# EAGLE design module_Rx_mux (EAGLE 6.5.0)

## Sheet 1 of 4
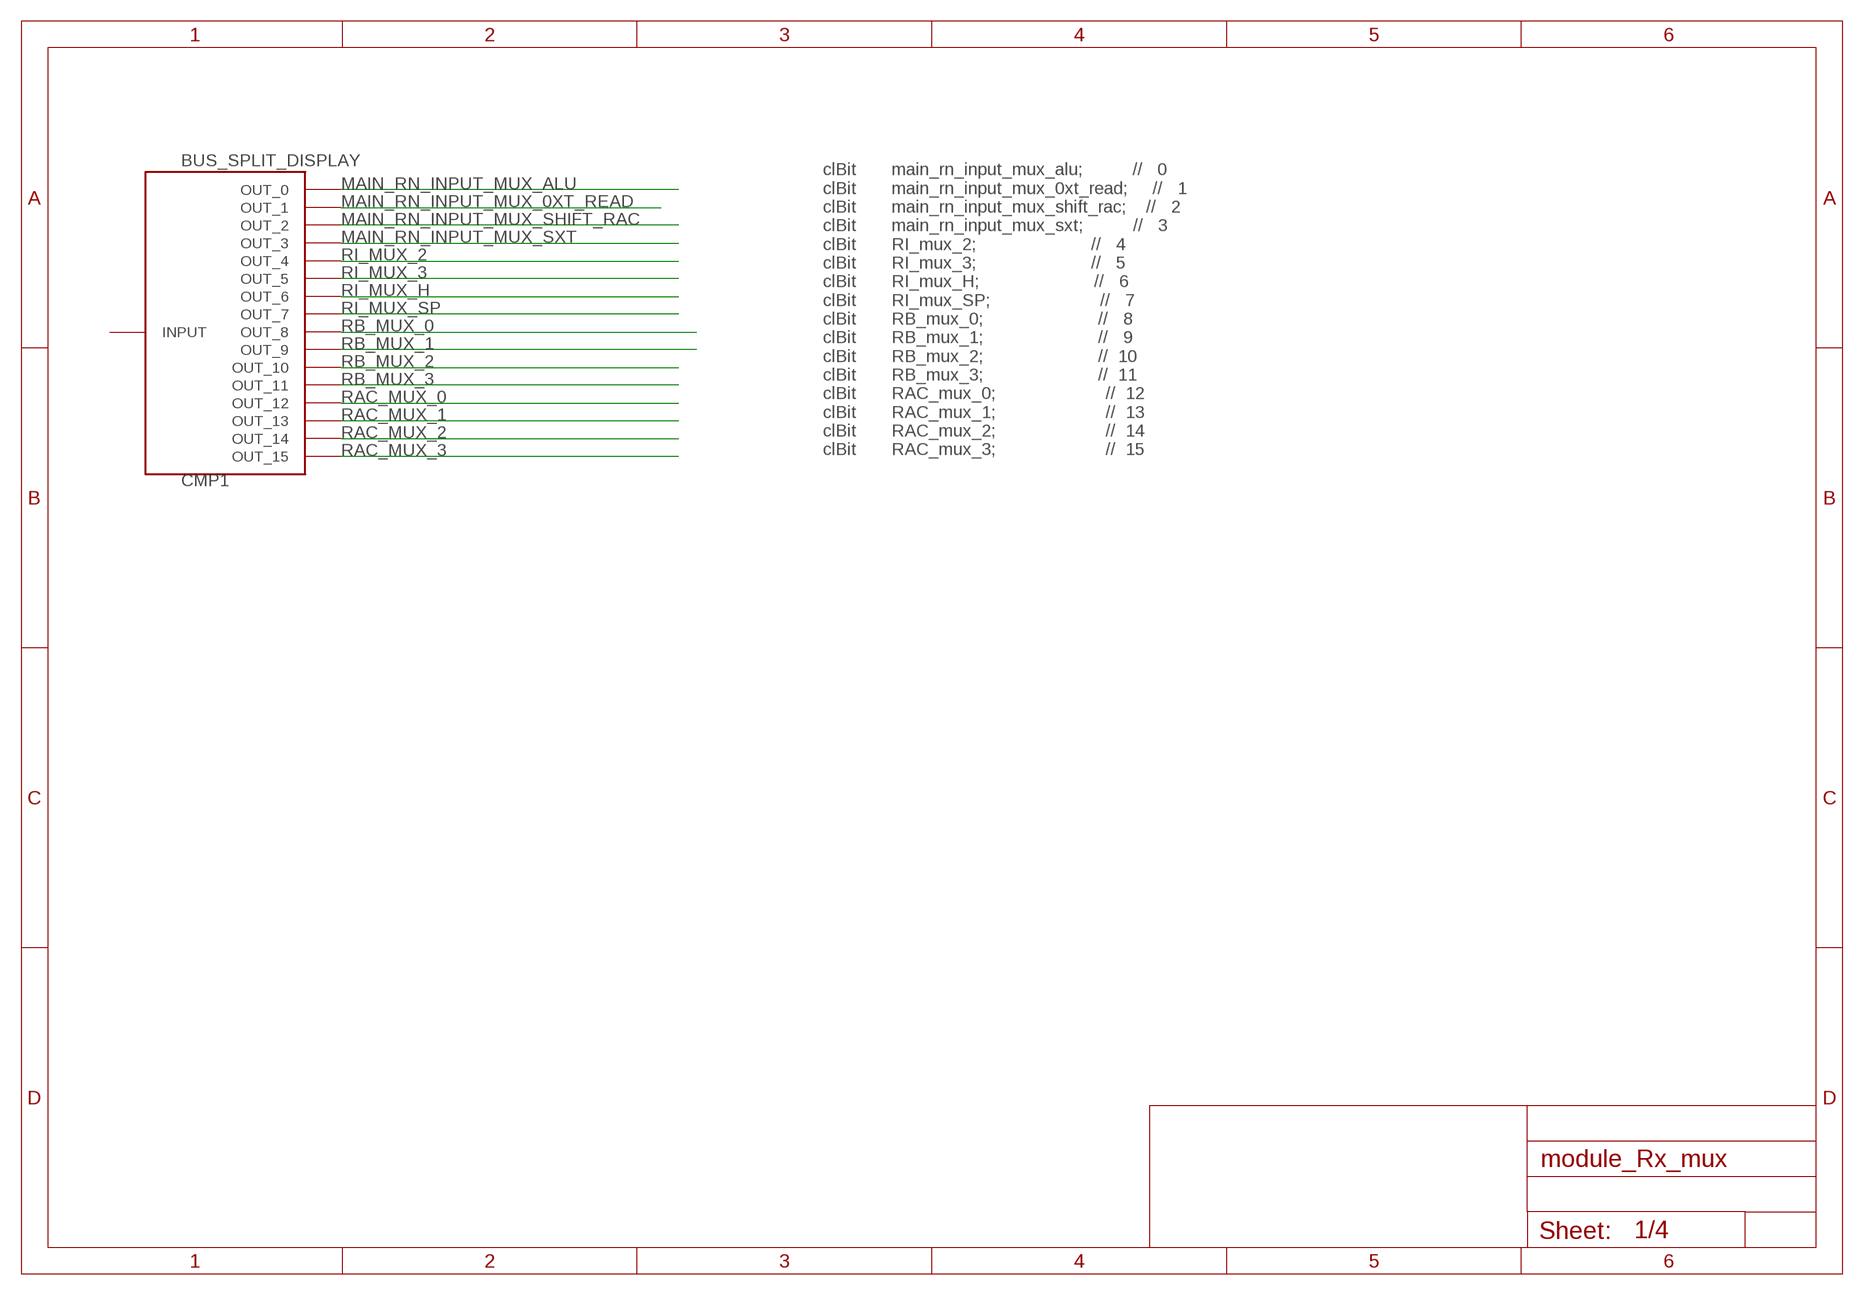
[diagram p0: schematic, sheet 1]

### Parts
CMP1  BUS_SPLIT_DISPLAY  [BUS_SPLIT_DISPLAY]

### Nets
MAIN_RN_INPUT_MUX_0XT_READ: CMP1.P$2(OUT_1) ; also sheet 4
MAIN_RN_INPUT_MUX_ALU: CMP1.P$1(OUT_0) ; also sheet 4
MAIN_RN_INPUT_MUX_SHIFT_RAC: CMP1.P$3(OUT_2) ; also sheet 4
MAIN_RN_INPUT_MUX_SXT: CMP1.P$4(OUT_3) ; also sheet 4
RAC_MUX_0: CMP1.P$13(OUT_12) ; also sheet 4
RAC_MUX_1: CMP1.P$14(OUT_13) ; also sheet 4
RAC_MUX_2: CMP1.P$15(OUT_14) ; also sheet 4
RAC_MUX_3: CMP1.P$16(OUT_15) ; also sheet 4
RB_MUX_0: CMP1.P$9(OUT_8) ; also sheet 4
RB_MUX_1: CMP1.P$10(OUT_9) ; also sheet 4
RB_MUX_2: CMP1.P$11(OUT_10) ; also sheet 4
RB_MUX_3: CMP1.P$12(OUT_11) ; also sheet 4
RI_MUX_2: CMP1.P$5(OUT_4) ; also sheet 4
RI_MUX_3: CMP1.P$6(OUT_5) ; also sheet 4
RI_MUX_H: CMP1.P$7(OUT_6) ; also sheet 4
RI_MUX_SP: CMP1.P$8(OUT_7) ; also sheet 4
Unconnected: CMP1.INPUT

### Notes on the sheet
- clBit       main_rn_input_mux_alu;          //   0
      clBit       main_rn_input_mux_0xt_read;     //   1
      clBit       main_rn_input_mux_shift_rac;    //   2
      clBit       main_rn_input_mux_sxt;          //   3
      clBit       RI_mux_2;                       //   4
      clBit       RI_mux_3;                       //   5
      clBit       RI_mux_H;                       //   6
      clBit       RI_mux_SP;                      //   7
      clBit       RB_mux_0;                       //   8
      clBit       RB_mux_1;                       //   9
      clBit       RB_mux_2;                       //  10
      clBit       RB_mux_3;                       //  11
      clBit       RAC_mux_0;                      //  12
      clBit       RAC_mux_1;                      //  13
      clBit       RAC_mux_2;                      //  14
      clBit       RAC_mux_3;                      //  15

## Sheet 2 of 4
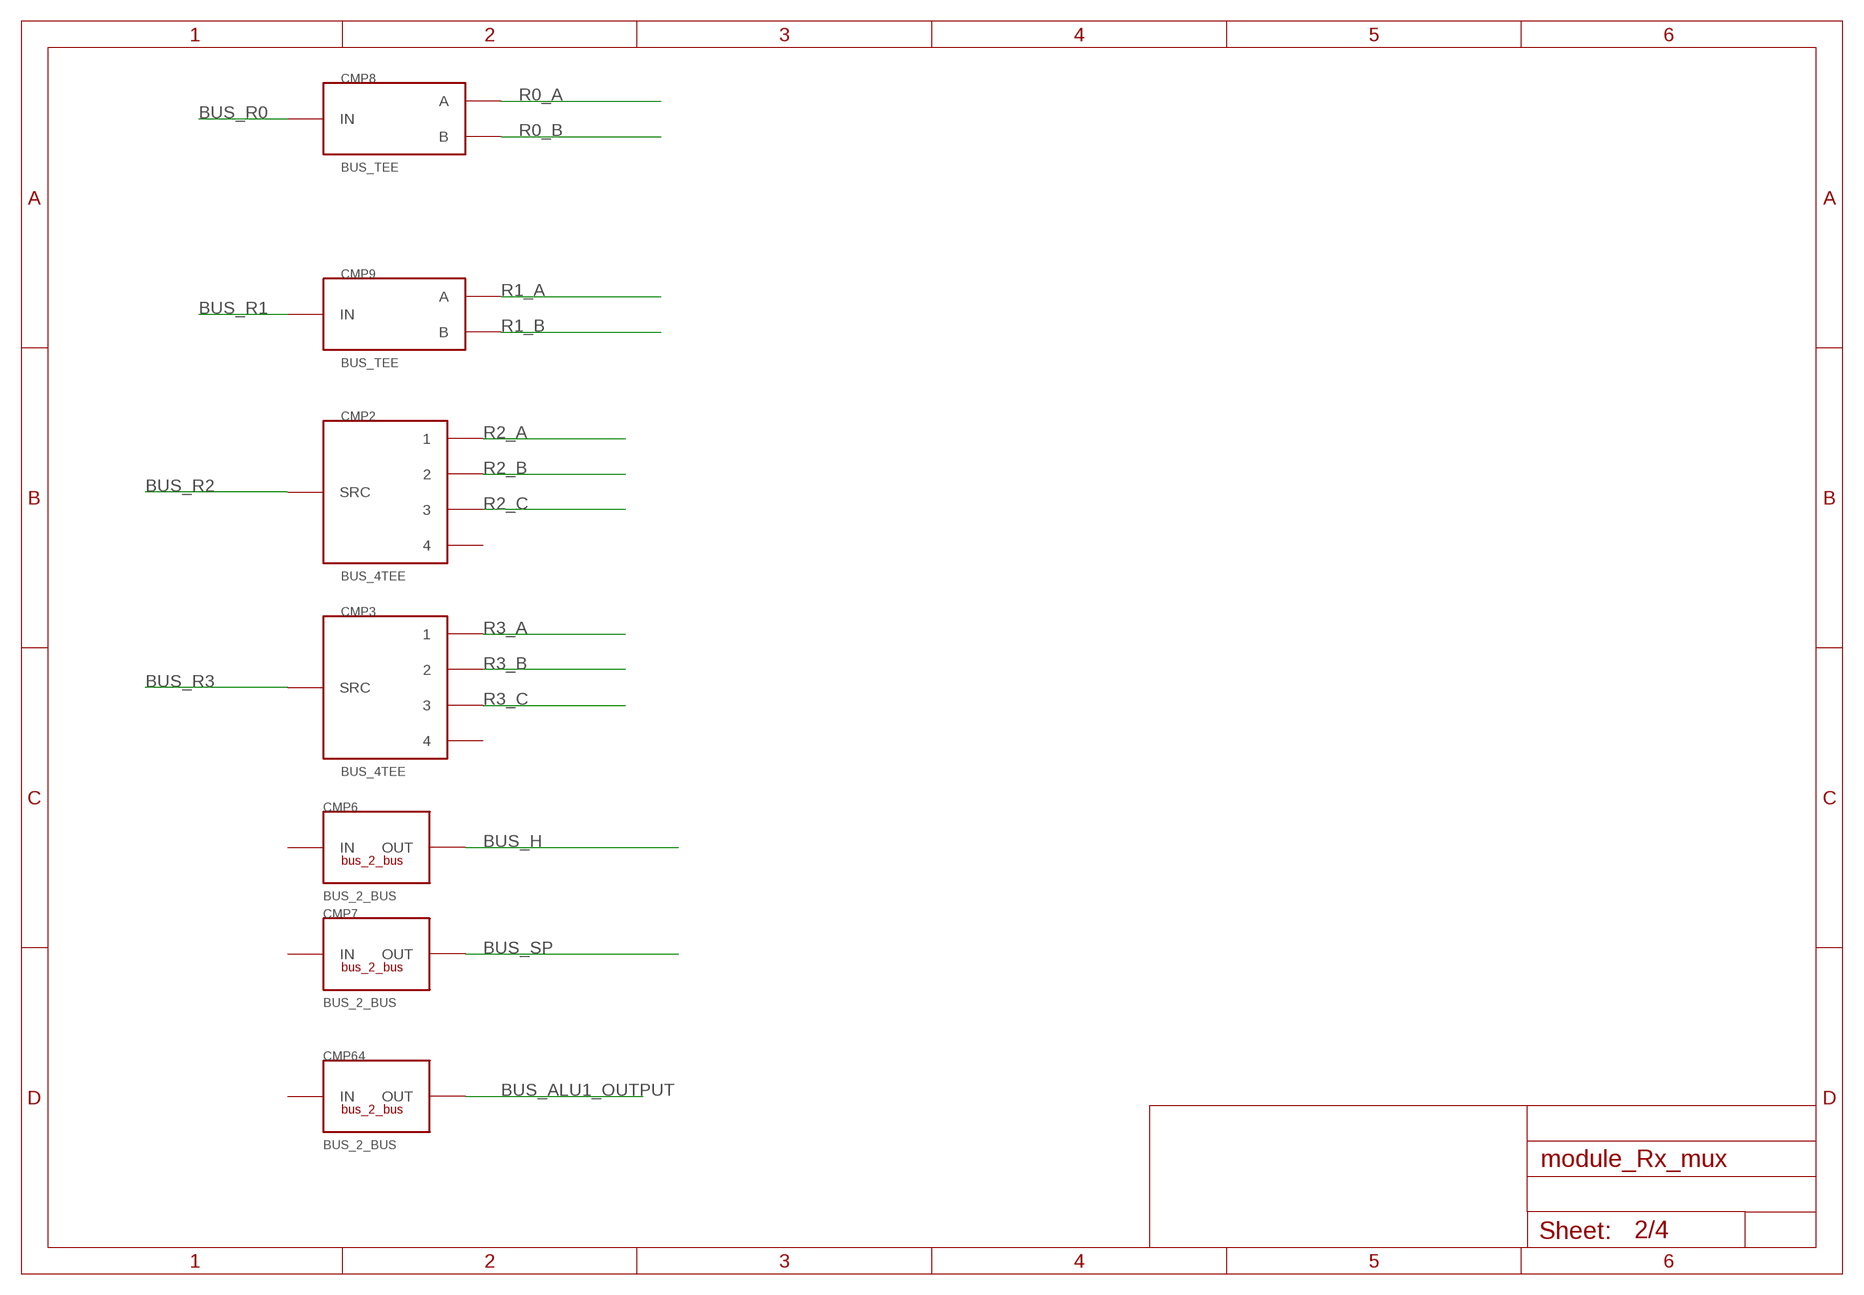
[diagram p1: schematic, sheet 2]

### Parts
CMP2  BUS_4TEE  [BUS_4TEE]
CMP3  BUS_4TEE  [BUS_4TEE]
CMP6  BUS_2_BUS  [BUS2BUS]
CMP7  BUS_2_BUS  [BUS2BUS]
CMP8  BUS_TEE  [BUS_TEE]
CMP9  BUS_TEE  [BUS_TEE]
CMP64  BUS_2_BUS  [BUS2BUS]

### Nets
BUS_ALU1_OUTPUT: CMP64.P$2(OUT) ; also sheet 4
BUS_H: CMP6.P$2(OUT) ; also sheet 4
BUS_R0: CMP8.INPUT(IN)
BUS_R1: CMP9.INPUT(IN)
BUS_R2: CMP2.SRC
BUS_R3: CMP3.SRC
BUS_SP: CMP7.P$2(OUT) ; also sheet 4
R0_A: CMP8.OUT_A(A) ; also sheet 4
R0_B: CMP8.OUTB(B) ; also sheet 4
R1_A: CMP9.OUT_A(A) ; also sheet 4
R1_B: CMP9.OUTB(B) ; also sheet 4
R2_A: CMP2.1 ; also sheet 4
R2_B: CMP2.2 ; also sheet 4
R2_C: CMP2.3 ; also sheet 4
R3_A: CMP3.1 ; also sheet 4
R3_B: CMP3.2 ; also sheet 4
R3_C: CMP3.3 ; also sheet 4
Unconnected: CMP2.4 CMP3.4 CMP6.P$1(IN) CMP7.P$1(IN) CMP64.P$1(IN)

## Sheet 3 of 4
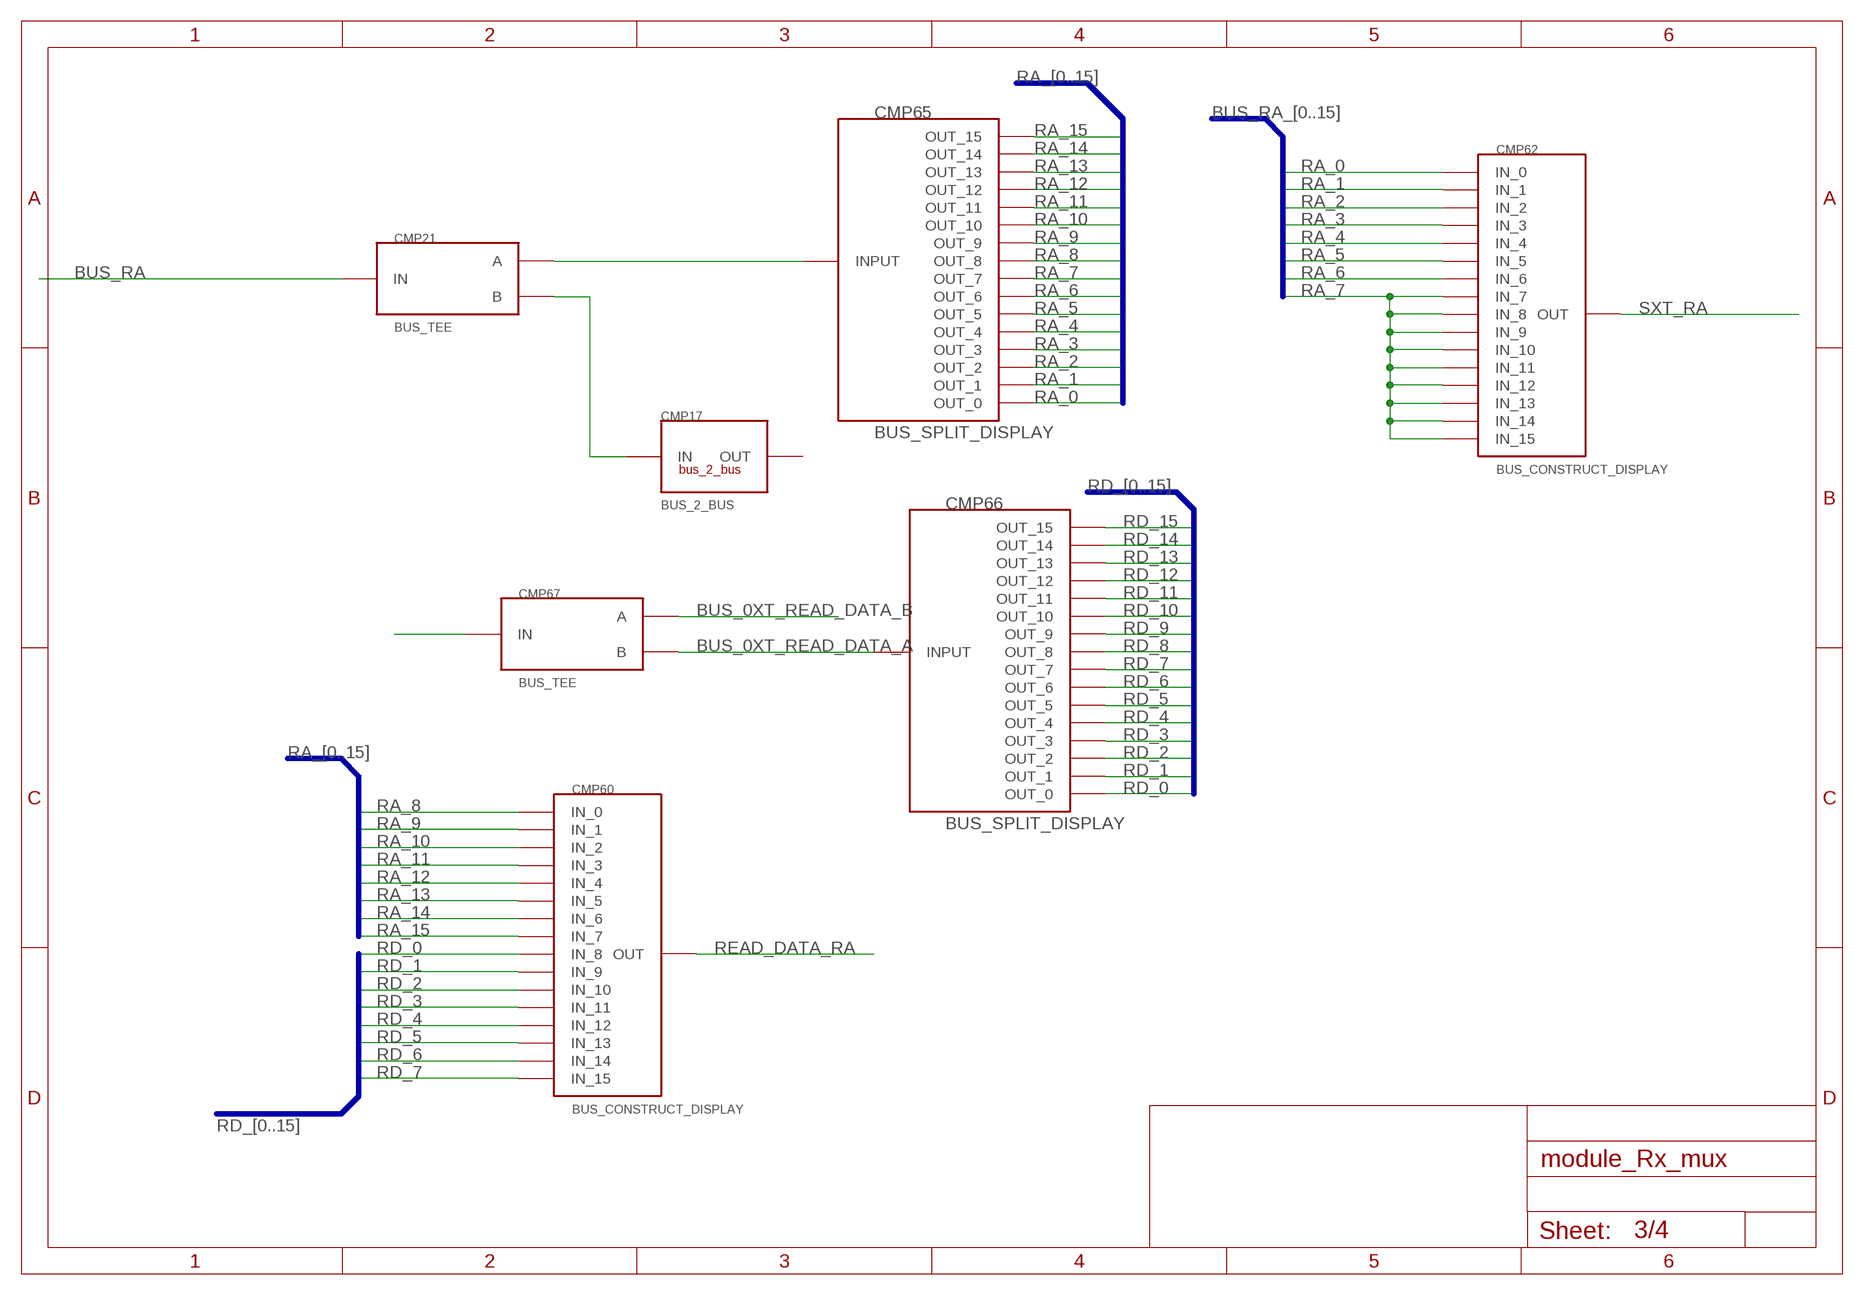
[diagram p2: schematic, sheet 3]

### Parts
CMP17  BUS_2_BUS  [BUS2BUS]
CMP21  BUS_TEE  [BUS_TEE]
CMP60  BUS_CONSTRUCT_DISPLAY  [BUS_SPLIT_DISPLAY]
CMP62  BUS_CONSTRUCT_DISPLAY  [BUS_SPLIT_DISPLAY]
CMP65  BUS_SPLIT_DISPLAY  [BUS_SPLIT_DISPLAY]
CMP66  BUS_SPLIT_DISPLAY  [BUS_SPLIT_DISPLAY]
CMP67  BUS_TEE  [BUS_TEE]

### Nets
BUS_0XT_READ_DATA_A: CMP66.INPUT CMP67.OUTB(B)
BUS_0XT_READ_DATA_B: CMP67.OUT_A(A) ; also sheet 4
BUS_RA: CMP21.INPUT(IN) ; also sheet 4
N$2: CMP21.OUT_A(A) CMP65.INPUT
N$3: CMP17.P$1(IN) CMP21.OUTB(B)
N$31: CMP67.INPUT(IN)
RA_0: CMP62.P$1(IN_0) CMP65.P$1(OUT_0)
RA_1: CMP62.P$2(IN_1) CMP65.P$2(OUT_1)
RA_2: CMP62.P$3(IN_2) CMP65.P$3(OUT_2)
RA_3: CMP62.P$4(IN_3) CMP65.P$4(OUT_3)
RA_4: CMP62.P$5(IN_4) CMP65.P$5(OUT_4)
RA_5: CMP62.P$6(IN_5) CMP65.P$6(OUT_5)
RA_6: CMP62.P$7(IN_6) CMP65.P$7(OUT_6)
RA_7: CMP62.P$8(IN_7) CMP62.P$9(IN_8) CMP62.P$10(IN_9) CMP62.P$11(IN_10) CMP62.P$12(IN_11) CMP62.P$13(IN_12) CMP62.P$14(IN_13) CMP62.P$15(IN_14) CMP62.P$16(IN_15) CMP65.P$8(OUT_7)
RA_8: CMP60.P$1(IN_0) CMP65.P$9(OUT_8)
RA_9: CMP60.P$2(IN_1) CMP65.P$10(OUT_9)
RA_10: CMP60.P$3(IN_2) CMP65.P$11(OUT_10)
RA_11: CMP60.P$4(IN_3) CMP65.P$12(OUT_11)
RA_12: CMP60.P$5(IN_4) CMP65.P$13(OUT_12)
RA_13: CMP60.P$6(IN_5) CMP65.P$14(OUT_13)
RA_14: CMP60.P$7(IN_6) CMP65.P$15(OUT_14)
RA_15: CMP60.P$8(IN_7) CMP65.P$16(OUT_15)
RD_0: CMP60.P$9(IN_8) CMP66.P$1(OUT_0)
RD_1: CMP60.P$10(IN_9) CMP66.P$2(OUT_1)
RD_2: CMP60.P$11(IN_10) CMP66.P$3(OUT_2)
RD_3: CMP60.P$12(IN_11) CMP66.P$4(OUT_3)
RD_4: CMP60.P$13(IN_12) CMP66.P$5(OUT_4)
RD_5: CMP60.P$14(IN_13) CMP66.P$6(OUT_5)
RD_6: CMP60.P$15(IN_14) CMP66.P$7(OUT_6)
RD_7: CMP60.P$16(IN_15) CMP66.P$8(OUT_7)
RD_8: CMP66.P$9(OUT_8)
RD_9: CMP66.P$10(OUT_9)
RD_10: CMP66.P$11(OUT_10)
RD_11: CMP66.P$12(OUT_11)
RD_12: CMP66.P$13(OUT_12)
RD_13: CMP66.P$14(OUT_13)
RD_14: CMP66.P$15(OUT_14)
RD_15: CMP66.P$16(OUT_15)
READ_DATA_RA: CMP60.INPUT(OUT) ; also sheet 4
SXT_RA: CMP62.INPUT(OUT) ; also sheet 4
Unconnected: CMP17.P$2(OUT)

### Buses
BUS_RA_[0..15]
RD_[0..15]
RA_[0..15]

## Sheet 4 of 4
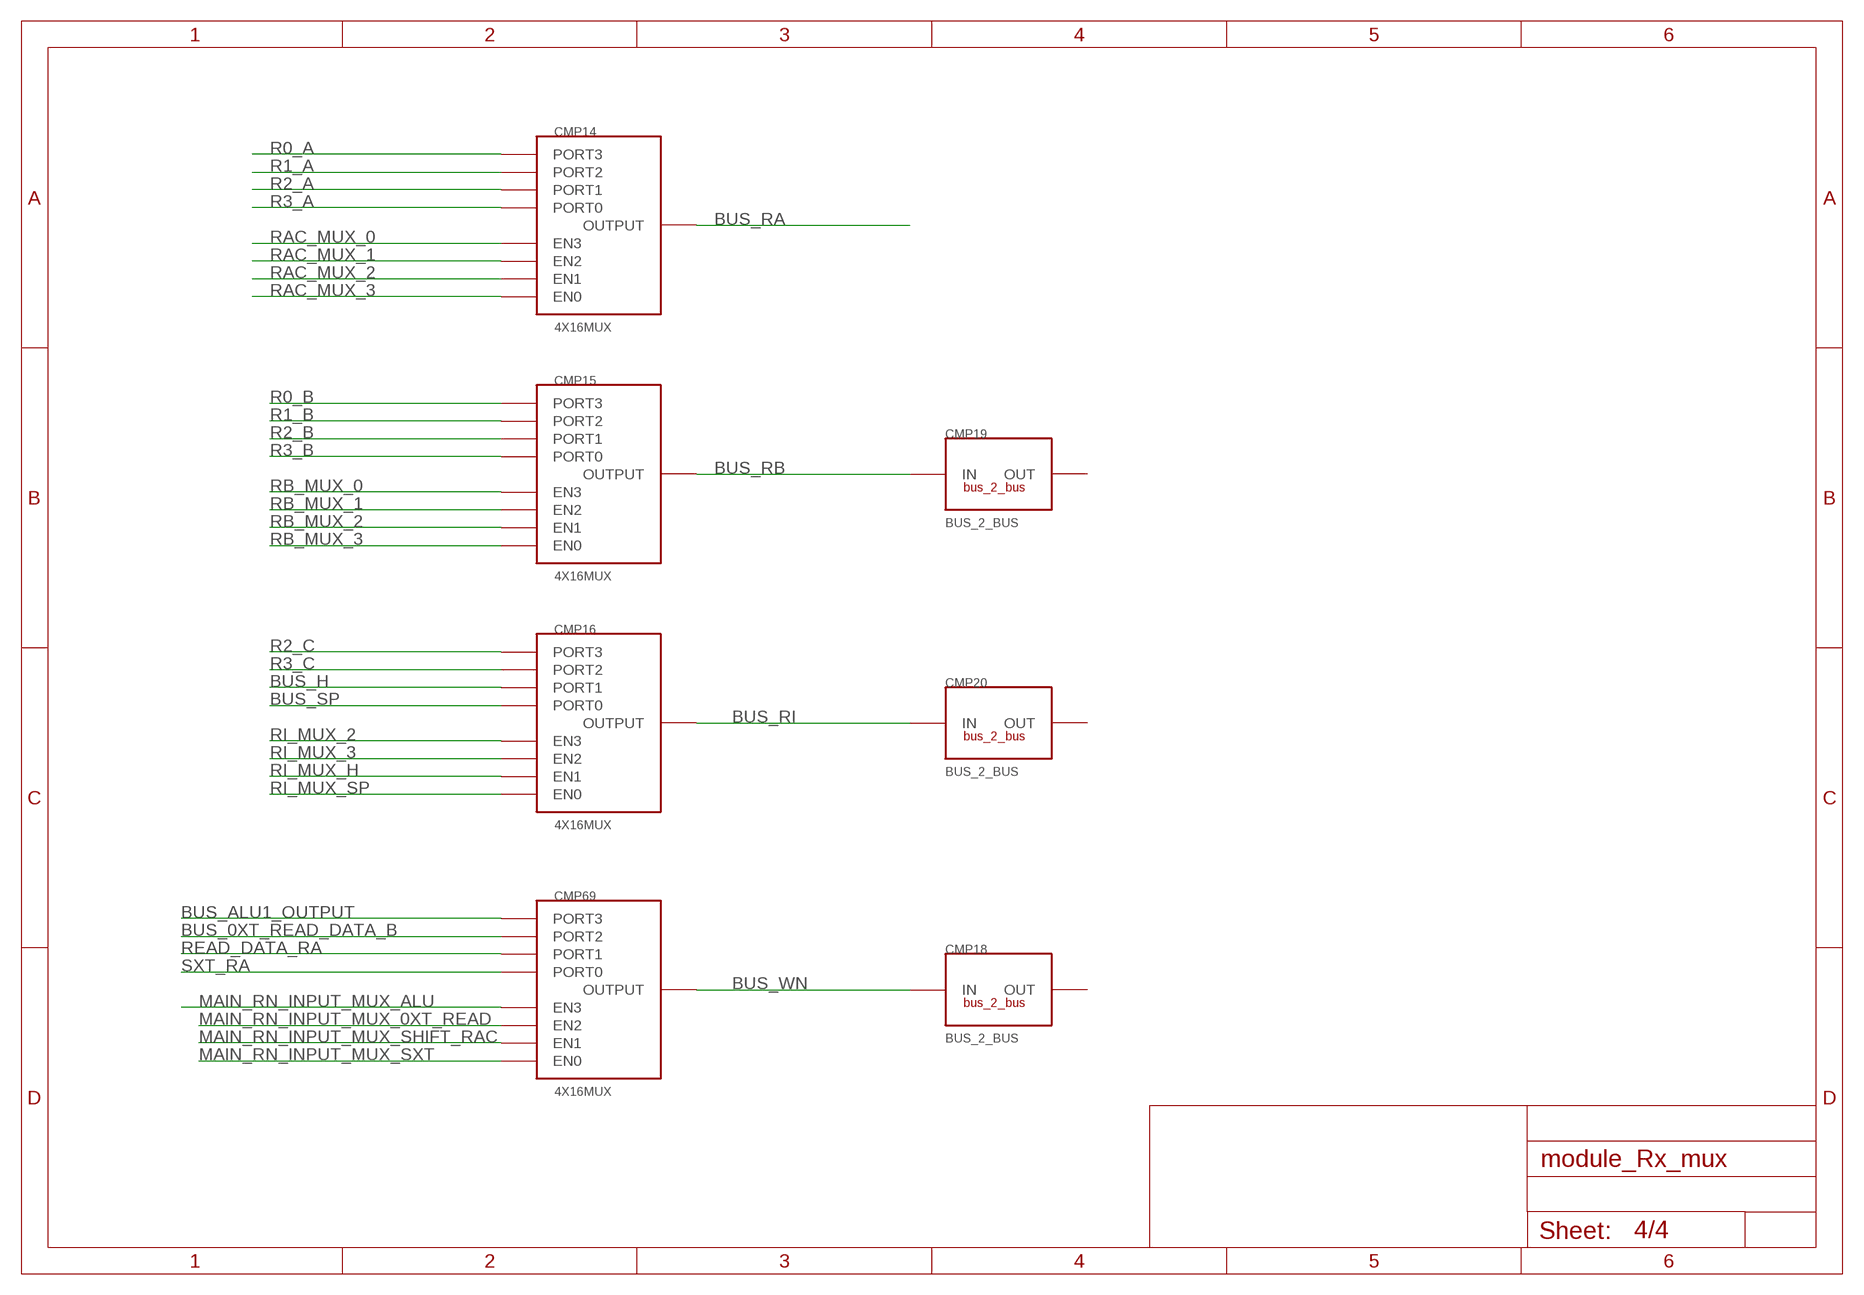
[diagram p3: schematic, sheet 4]

### Parts
CMP14  4X16MUX  [4X16MUX]
CMP15  4X16MUX  [4X16MUX]
CMP16  4X16MUX  [4X16MUX]
CMP18  BUS_2_BUS  [BUS2BUS]
CMP19  BUS_2_BUS  [BUS2BUS]
CMP20  BUS_2_BUS  [BUS2BUS]
CMP69  4X16MUX  [4X16MUX]

### Nets
BUS_0XT_READ_DATA_B: CMP69.PORT2 ; also sheet 3
BUS_ALU1_OUTPUT: CMP69.PORT3 ; also sheet 2
BUS_H: CMP16.PORT1 ; also sheet 2
BUS_RA: CMP14.PORTOUT(OUTPUT) ; also sheet 3
BUS_RB: CMP15.PORTOUT(OUTPUT) CMP19.P$1(IN)
BUS_RI: CMP16.PORTOUT(OUTPUT) CMP20.P$1(IN)
BUS_SP: CMP16.PORT0 ; also sheet 2
BUS_WN: CMP18.P$1(IN) CMP69.PORTOUT(OUTPUT)
MAIN_RN_INPUT_MUX_0XT_READ: CMP69.EN2 ; also sheet 1
MAIN_RN_INPUT_MUX_ALU: CMP69.EN3 ; also sheet 1
MAIN_RN_INPUT_MUX_SHIFT_RAC: CMP69.EN1 ; also sheet 1
MAIN_RN_INPUT_MUX_SXT: CMP69.EN0 ; also sheet 1
R0_A: CMP14.PORT3 ; also sheet 2
R0_B: CMP15.PORT3 ; also sheet 2
R1_A: CMP14.PORT2 ; also sheet 2
R1_B: CMP15.PORT2 ; also sheet 2
R2_A: CMP14.PORT1 ; also sheet 2
R2_B: CMP15.PORT1 ; also sheet 2
R2_C: CMP16.PORT3 ; also sheet 2
R3_A: CMP14.PORT0 ; also sheet 2
R3_B: CMP15.PORT0 ; also sheet 2
R3_C: CMP16.PORT2 ; also sheet 2
RAC_MUX_0: CMP14.EN3 ; also sheet 1
RAC_MUX_1: CMP14.EN2 ; also sheet 1
RAC_MUX_2: CMP14.EN1 ; also sheet 1
RAC_MUX_3: CMP14.EN0 ; also sheet 1
RB_MUX_0: CMP15.EN3 ; also sheet 1
RB_MUX_1: CMP15.EN2 ; also sheet 1
RB_MUX_2: CMP15.EN1 ; also sheet 1
RB_MUX_3: CMP15.EN0 ; also sheet 1
READ_DATA_RA: CMP69.PORT1 ; also sheet 3
RI_MUX_2: CMP16.EN3 ; also sheet 1
RI_MUX_3: CMP16.EN2 ; also sheet 1
RI_MUX_H: CMP16.EN1 ; also sheet 1
RI_MUX_SP: CMP16.EN0 ; also sheet 1
SXT_RA: CMP69.PORT0 ; also sheet 3
Unconnected: CMP18.P$2(OUT) CMP19.P$2(OUT) CMP20.P$2(OUT)

## Library data of the parts
CMP1 CMP65 CMP66 = modules:BUS_SPLIT_DISPLAY
CMP2 CMP3 = modules:BUS_4TEE
CMP6 CMP7 CMP17-CMP20 CMP64 = modules:BUS_2_BUS
CMP8 CMP9 CMP21 CMP67 = modules:BUS_TEE
CMP14-CMP16 CMP69 = modules:4X16MUX
CMP60 CMP62 = modules:BUS_CONSTRUCT_DISPLAY

## Board
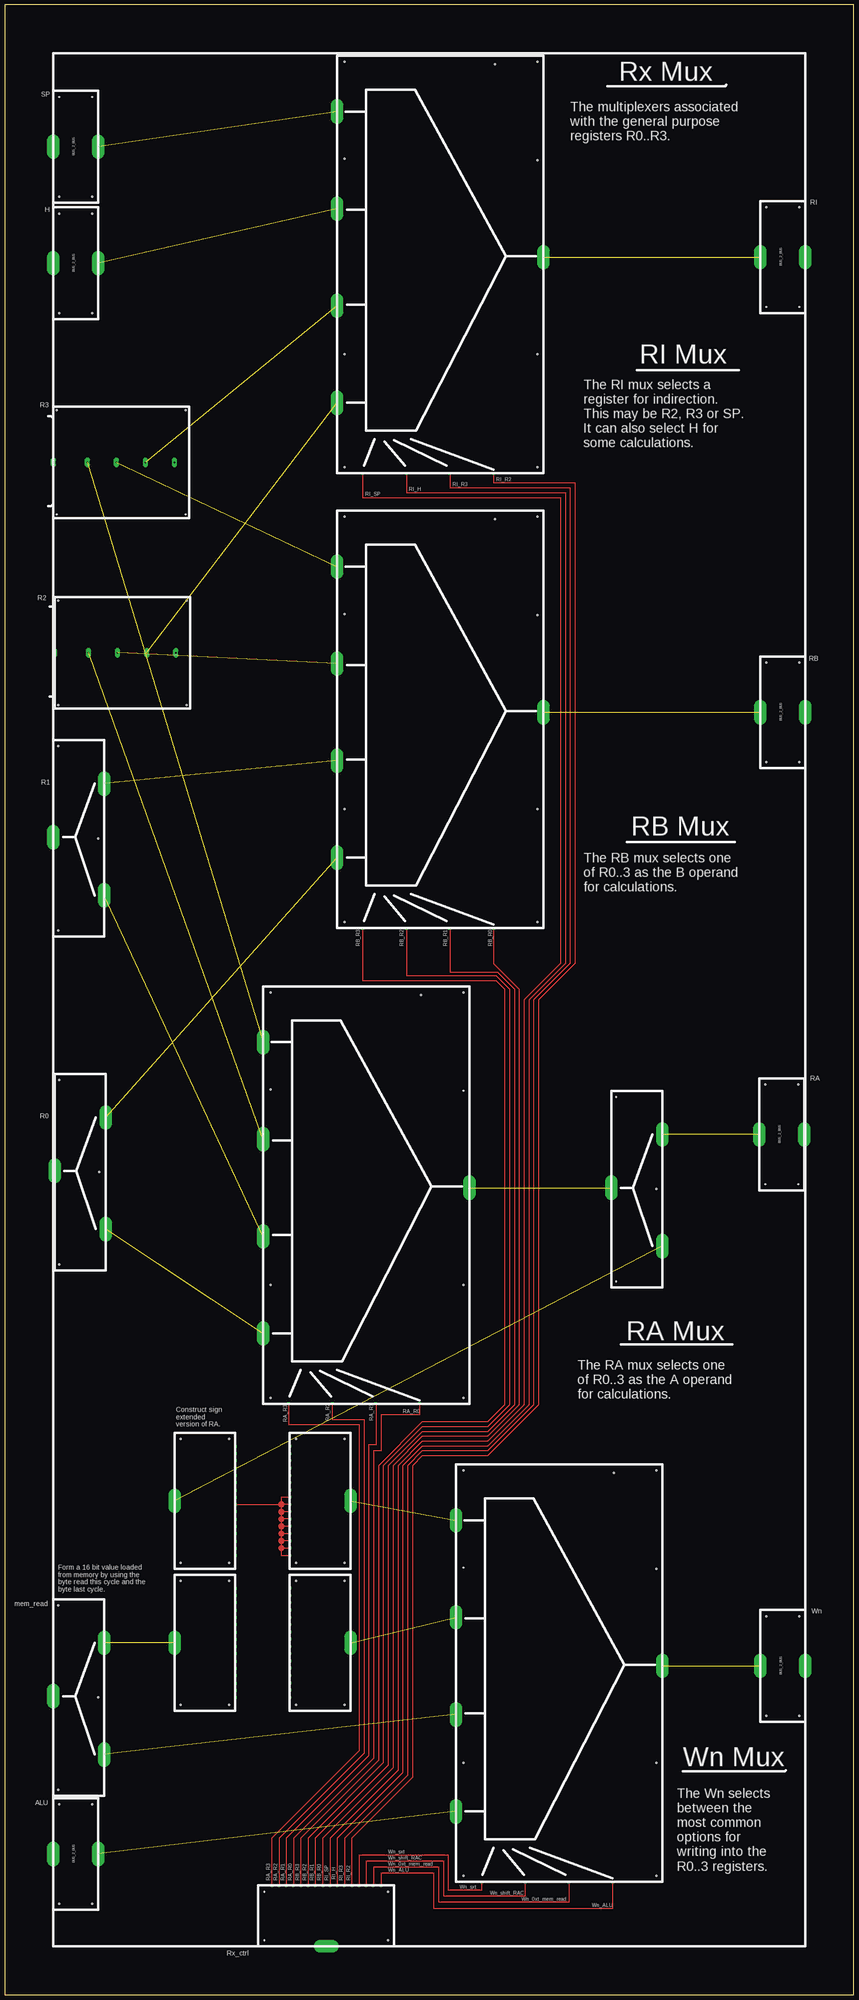
[diagram p4: board, top side]
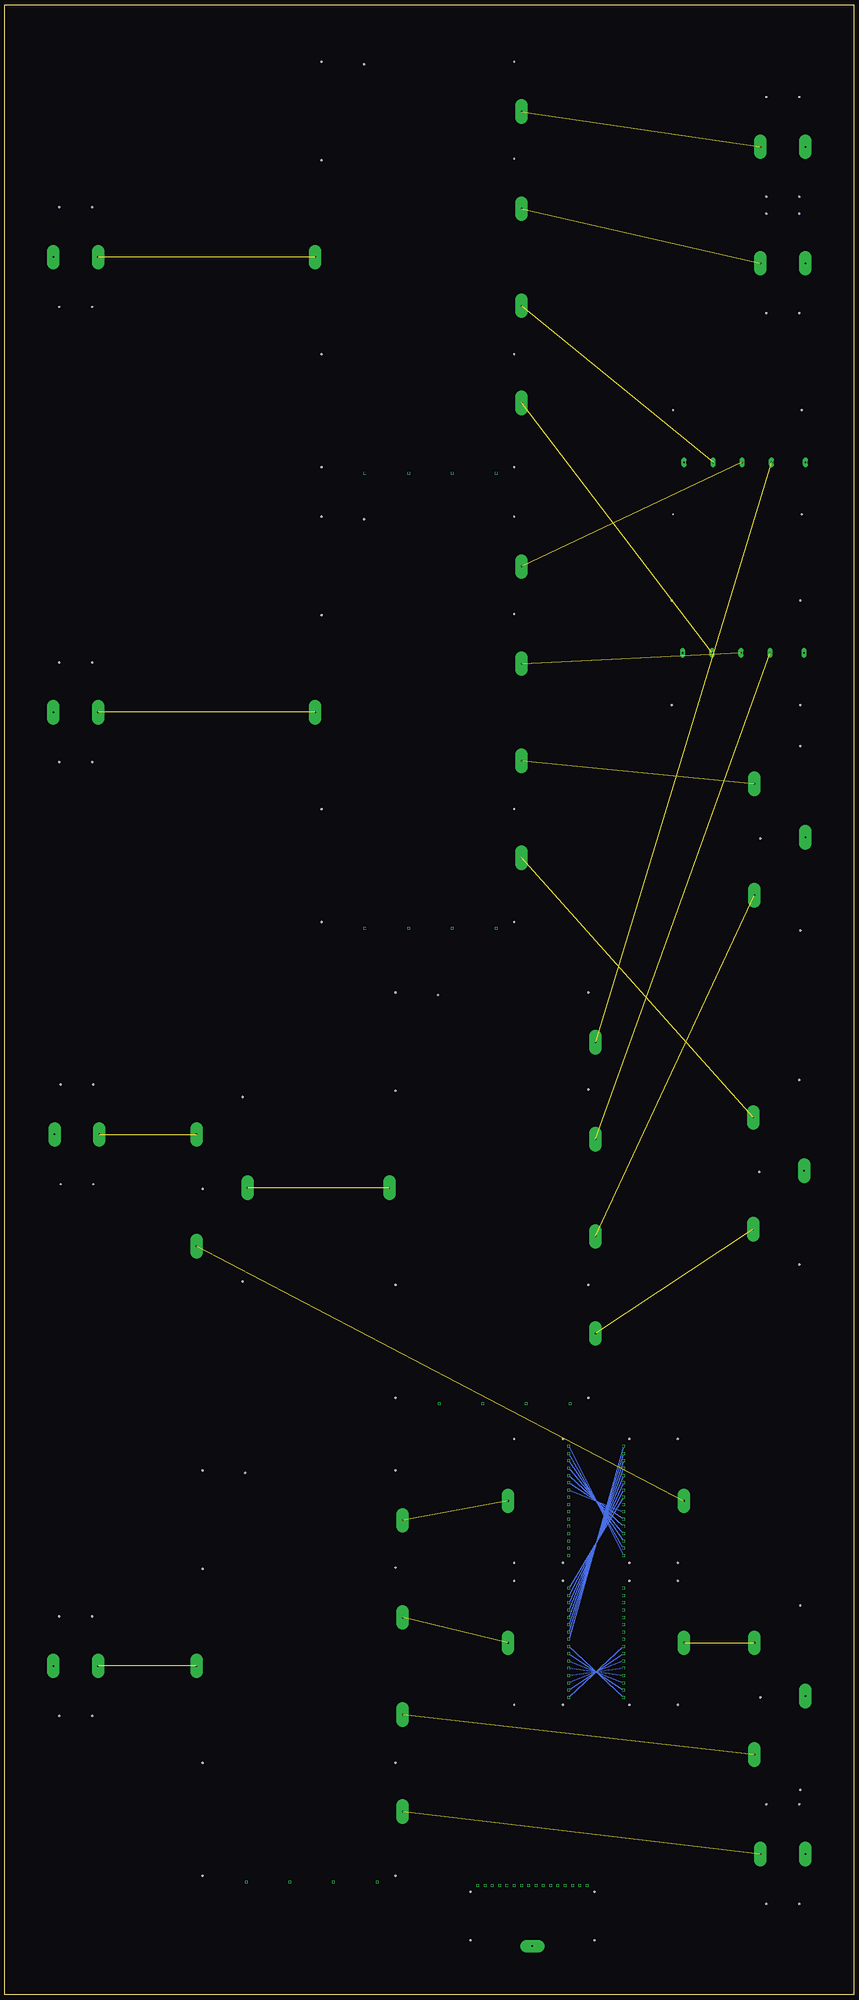
[diagram p5: board, bottom side, seen from below]

Size 444.5 x 1041.4 mm. Coordinates in mm from the lower left corner, seen from the top.
Outline: 444.5,0 444.5,1041.4 0,1041.4 0,0 444.5,0
Copper layers (1*16): Top 0.035mm / dielectric 1.5mm / Bottom 0.035mm
Design rules "default": minimum track width 10mil, minimum drill 24mil, track to track 8mil, track to pad 8mil, pad to pad 8mil, via to via 8mil, smd to smd 8mil, copper to edge 40mil, drill to drill 8mil, minimum pad ring 10mil, minimum via ring 8mil, stop-mask expansion 4mil, vias tented up to drill 0mil, thermal gap 10mil
tKeepout: area 16.3,1006.9 to 34.5,1025.1; area 16.3,16.3 to 34.5,34.5; area 410,16.3 to 428.2,34.5; area 410,511.6 to 428.2,529.8; area 16.3,511.6 to 34.5,529.8; area 410,1006.9 to 428.2,1025.1

### Footprints (pad centres in the part's own frame; a part is rotated, then mirrored left to right if it is on the bottom)
BUS_SPLIT_DISPLAY = drill 0.8 pad 6.452 long: INPUT 0,15.24 | drill 0.8 square: P$1 -28.575,-16.51; P$2 -24.765,-16.51; P$3 -20.955,-16.51; P$4 -17.145,-16.51; P$5 -13.335,-16.51; P$6 -9.525,-16.51; P$7 -5.715,-16.51; P$8 -1.905,-16.51; P$9 1.905,-16.51; P$10 5.715,-16.51; P$11 9.525,-16.51; P$12 13.335,-16.51; P$13 17.145,-16.51; P$14 20.955,-16.51; P$15 24.765,-16.51; P$16 28.575,-16.51 | hole 0.6: -32.385,-13.335; -32.385,12.065; 32.385,12.065; 32.385,-13.335
BUS_4TEE = drill 0.8 pad 2.54 long: 1 2.54,12.7; 2 2.54,-2.54; 3 2.54,-17.78; 4 2.54,-33.02; SRC 2.54,30.48 | hole 0.6: -24.765,28.575; 29.845,28.575; 29.845,-38.735; -24.765,-38.735
BUS2BUS = drill 0.8 pad 6.452 long: P$1 -1.27,12.7; P$2 -1.27,-10.795 | hole 0.6: -27.305,-7.62; -27.305,9.525; 24.765,9.525; 24.765,-7.62
BUS_TEE = drill 0.8 pad 6.452 long: INPUT 0,15.24; OUT_A -30.48,-11.43; OUTB 27.94,-11.43 | hole 0.6: -48.895,12.7; -0.635,-8.255; 47.625,12.7
4X16MUX = drill 0.8 square: EN0 -113.03,38.735; EN1 -113.03,15.875; EN2 -113.03,-6.985; EN3 -113.03,-29.845 | drill 0.8 pad 6.452 long: PORT0 76.2,52.07; PORT1 25.4,52.07; PORT2 -25.4,52.07; PORT3 -76.2,52.07; PORTOUT 0,-55.88 | hole 0.6: -109.855,-52.705; -50.8,-52.705; 50.8,-52.705; 102.235,-52.705; 102.235,48.26; 51.435,48.26; -50.8,48.26; -109.855,48.26; 100.965,-30.48

### Placement (x,y rotation side)
CMP1  168.28,40.64 180 top
CMP2  56.52,699.77 90 top
CMP3  55.88,799.47 90 top
CMP6  38.1,907.41 90 top
CMP7  38.1,968.38 90 top
CMP8  41.27,431.17 90 top
CMP9  40.64,605.79 90 top
CMP14  187.32,422.27 90 top
CMP15  226.06,671.2 90 top
CMP16  226.06,909.32 90 top
CMP17  407.67,451.49 90 top
CMP18  408.31,173.35 90 top
CMP19  408.31,672.47 90 top
CMP20  408.31,910.59 90 top
CMP21  332.74,422.27 90 top
CMP60  165.74,184.15 270 top
CMP62  165.74,258.44 270 top
CMP64  38.1,74.93 90 top
CMP65  104.14,258.44 90 top
CMP66  104.14,184.15 90 top
CMP67  40.64,156.21 90 top
CMP69  288.29,172.09 90 top

### Tracks (layer width: path | path; a pad name or v marks a point on that pad's centre or on a via)
BUS_0XT_READ_DATA_A  (1 unrouted)
BUS_0XT_READ_DATA_B  (1 unrouted)
BUS_ALU1_OUTPUT  (1 unrouted)
BUS_H  (1 unrouted)
BUS_RA  (1 unrouted)
BUS_RB  (1 unrouted)
BUS_RI  (1 unrouted)
BUS_SP  (1 unrouted)
BUS_WN  (1 unrouted)
MAIN_RN_INPUT_MUX_0XT_READ
  Top 0.61: CMP69.EN2 295.27,48.26 227.33,48.26 227.33,66.67 193.04,66.67 CMP1.P$2
MAIN_RN_INPUT_MUX_ALU
  Top 0.61: CMP69.EN3 318.13,45.09 224.79,45.09 224.79,63.5 196.85,63.5 CMP1.P$1
MAIN_RN_INPUT_MUX_SHIFT_RAC
  Top 0.61: CMP69.EN1 272.42,51.44 229.87,51.44 229.87,69.85 189.23,69.85 CMP1.P$3
MAIN_RN_INPUT_MUX_SXT
  Top 0.61: CMP69.EN0 249.56,54.61 232.41,54.61 232.41,73.03 185.42,73.03 CMP1.P$4
N$2  (1 unrouted)
N$3  (1 unrouted)
R0_A  (1 unrouted)
R0_B  (1 unrouted)
R1_A  (1 unrouted)
R1_B  (1 unrouted)
R2_A  (1 unrouted)
R2_B  (1 unrouted)
R2_C  (1 unrouted)
R3_A  (1 unrouted)
R3_B  (1 unrouted)
R3_C  (1 unrouted)
RA_0
  Bottom 0.254: CMP62.P$1 CMP65.P$1
RA_1
  Bottom 0.254: CMP65.P$2 CMP62.P$2
RA_2
  Bottom 0.254: CMP62.P$3 CMP65.P$3
RA_3
  Bottom 0.254: CMP65.P$4 CMP62.P$4
RA_4
  Bottom 0.254: CMP62.P$5 CMP65.P$5
RA_5
  Bottom 0.254: CMP65.P$6 CMP62.P$6
RA_6
  Bottom 0.254: CMP62.P$7 CMP65.P$7
RA_7
  Top 0.254: CMP65.P$8 144.78,256.54
  Top 0.61: CMP62.P$8 144.78,260.35 144.78,256.54 | 144.78,256.54 144.78,252.73 | 144.78,252.73 144.78,248.92 | 144.78,248.92 144.78,245.11 | 144.78,245.11 144.78,241.3 | 144.78,241.3 144.78,237.49 | 144.78,237.49 144.78,233.68 | 144.78,233.68 144.78,229.87 CMP62.P$16 | CMP62.P$15 144.78,233.68 | CMP62.P$14 144.78,237.49 | CMP62.P$13 144.78,241.3 | CMP62.P$12 144.78,245.11 | CMP62.P$11 144.78,248.92 | CMP62.P$10 144.78,252.73 | CMP62.P$9 144.78,256.54
RA_8
  Bottom 0.254: CMP65.P$9 CMP60.P$1
RA_9
  Bottom 0.254: CMP65.P$10 CMP60.P$2
RA_10
  Bottom 0.254: CMP65.P$11 CMP60.P$3
RA_11
  Bottom 0.254: CMP65.P$12 CMP60.P$4
RA_12
  Bottom 0.254: CMP65.P$13 CMP60.P$5
RA_13
  Bottom 0.254: CMP65.P$14 CMP60.P$6
RA_14
  Bottom 0.254: CMP65.P$15 CMP60.P$7
RA_15
  Bottom 0.254: CMP65.P$16 CMP60.P$8
RAC_MUX_0
  Top 0.61: CMP14.EN3 217.17,303.53 196.85,303.53 196.85,284.48 193.04,284.48 193.04,123.83 151.13,81.92 CMP1.P$13
RAC_MUX_1
  Top 0.61: CMP14.EN2 194.31,287.65 190.5,287.65 190.5,125.09 147.32,81.92 CMP1.P$14
RAC_MUX_2
  Top 0.61: CMP14.EN1 171.45,300.99 187.96,300.99 187.96,126.36 143.51,81.92 CMP1.P$15
RAC_MUX_3
  Top 0.61: CMP14.EN0 148.59,298.45 185.42,298.45 185.42,127.64 139.7,81.92 CMP1.P$16
RB_MUX_0
  Top 0.61: CMP15.EN3 255.91,539.75 269.24,526.41 269.24,308.61 252.73,292.1 218.44,292.1 203.2,276.86 203.2,118.75 166.37,81.92 CMP1.P$9
RB_MUX_1
  Top 0.61: CMP15.EN2 233.04,535.3 257.81,535.3 266.7,526.41 266.7,308.61 252.73,294.64 218.44,294.64 200.66,276.86 200.66,120.02 162.56,81.92 CMP1.P$10
RB_MUX_2
  Top 0.61: CMP15.EN1 210.19,533.4 257.18,533.4 264.16,526.41 264.16,308.61 252.73,297.18 218.44,297.18 198.12,276.86 198.12,121.28 158.75,81.92 CMP1.P$11
RB_MUX_3
  Top 0.61: CMP15.EN0 187.32,530.86 257.18,530.86 261.62,526.41 261.62,308.61 252.73,299.72 218.44,299.72 195.58,276.86 195.58,122.56 154.94,81.92 CMP1.P$12
RD_0
  Bottom 0.254: CMP66.P$1 CMP60.P$9
RD_1
  Bottom 0.254: CMP60.P$10 CMP66.P$2
RD_2
  Bottom 0.254: CMP60.P$11 CMP66.P$3
RD_3
  Bottom 0.254: CMP66.P$4 CMP60.P$12
RD_4
  Bottom 0.254: CMP66.P$5 CMP60.P$13
RD_5
  Bottom 0.254: CMP66.P$6 CMP60.P$14
RD_6
  Bottom 0.254: CMP66.P$7 CMP60.P$15
RD_7
  Bottom 0.254: CMP66.P$8 CMP60.P$16
READ_DATA_RA  (1 unrouted)
RI_MUX_2
  Top 0.61: CMP16.EN3 255.91,791.21 298.45,791.21 298.45,539.75 279.4,520.7 279.4,308.61 252.73,281.94 218.44,281.94 213.36,276.86 213.36,113.67 181.61,81.92 CMP1.P$5
RI_MUX_3
  Top 0.61: CMP16.EN2 233.04,788.67 295.91,788.67 295.91,539.75 276.86,520.7 276.86,308.61 252.73,284.48 218.44,284.48 210.82,276.86 210.82,114.94 177.8,81.92 CMP1.P$6
RI_MUX_H
  Top 0.61: CMP16.EN1 210.19,786.13 293.37,786.13 293.37,539.75 274.32,520.7 274.32,308.61 252.73,287.02 218.44,287.02 208.28,276.86 208.28,116.2 173.99,81.92 CMP1.P$7
RI_MUX_SP
  Top 0.61: CMP16.EN0 187.32,783.59 290.83,783.59 290.83,539.75 271.78,520.7 271.78,308.61 252.73,289.56 218.44,289.56 205.74,276.86 205.74,117.47 170.18,81.92 CMP1.P$8
SXT_RA  (1 unrouted)
(copper drawn outside any net)
  shapes: Top circle x7

### Text on the board
tPlace: Rx Mux | SP | The multiplexers associated / with the general purpose / registers R0..R3. | RI | H | RI Mux | R3 | The RI mux selects a / register for indirection. / This may be R2, R3 or SP. / It can also select H for / some calculations. | RI_R2 | RI_R3 | RI_H | RI_SP | R2 | RB | R1 | RB Mux | The RB mux selects one / of R0..3 as the B operand / for calculations. | RB_R3 | RB_R2 | RB_R1 | RB_R0 | RA | R0 | RA Mux | The RA mux selects one / of R0..3 as the A operand / for calculations. | RA_R0 | RA_R3 | RA_R2 | RA_R1 | Construct sign / extended / version of RA. | Form a 16 bit value loaded / from memory by using the / byte read this cycle and the / byte last cycle. | mem_read | Wn | Wn Mux | ALU | Wn_sxt | Wn_shift_RAC | Wn_0xt_mem_read | The Wn selects / between the / most common / options for / writing into the / R0..3 registers. | Wn_ALU | RA_R3 | RA_R2 | RA_R1 | RA_R0 | RB_R3 | RB_R2 | RB_R1 | RB_R0 | RI_SP | RI_H | RI_R3 | RI_R2 | Wn_sxt | Wn_shift_RAC | Wn_0xt_mem_read | Wn_ALU | Rx_ctrl